# Altium schematic sheet HW_Mechanical_Parts.SchDoc: Mechanical parts
size A4; Date: Not used; ApprovedBy: Not used; CheckedBy: Not used; Author: Not used; CompanyName: STMicroelectronics; DrawnBy: Not used; Engineer: Not used; Organization: Not used; Address1: Not used; Address2: Not used; Address3: Not used; Address4: Not used; DocumentNumber: Not used; Revision: Not used; SheetNumber: 8; SheetTotal: 8; CurrentTime: Not used; CurrentDate: Not used; Time: Not used; DocumentFullPathAndName: Not used; DocumentName: Not used; ModifiedDate: Not used; ImagePath: Not used; ProjectName: Not used; Application_BuildNumber: Not used
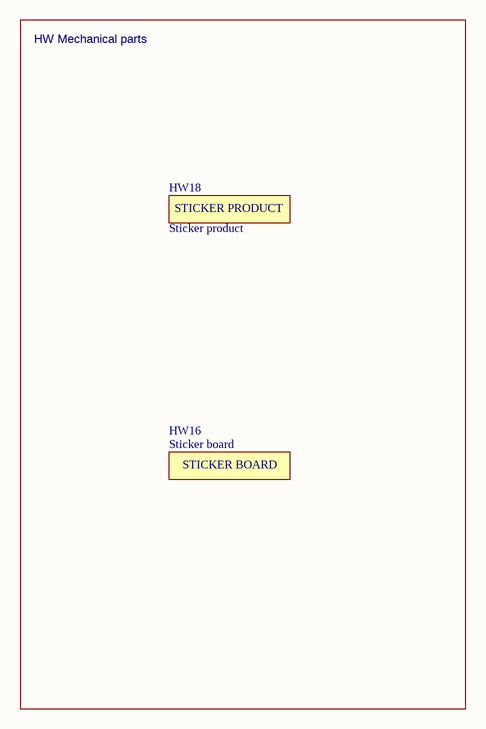
[diagram p0: HW_Mechanical_Parts.SchDoc]

## Parts
HW16  value Sticker board  [STICKER_BOARD_25X9]  (hidden comment: STICKER_BOARD)  (no BOM)
HW18  value Sticker product  [STICKER_PRODUCT_25X9]  (hidden comment: STICKER_PRODUCT)  (no BOM)

## Blocks framed on the sheet
HW Mechanical parts: HW16 HW18

## Notes on the sheet
- Title:
- Project:
- Size:
- Revision:
- Variant:
- A4
- -
- Date:
- Reference:
- Sheet:
- of
- (in symbol MCD-00235) STICKER BOARD
- (in symbol MCD-00547) STICKER PRODUCT

## Library data of the parts
HW16 = MCD-00235: Sticker Board 25x9 mm; Part_Type: Misc; Part_Preference: Recommended; Internal_Part_Number: MCD-00235; Status: Released; Manufacturer_Part_Number: N/A; Manufacturer: N/A; ComponentLink1URL: N/A; Alternate_Manufacturer: N/A; Alternate_Manufacturer_Part_Number: N/A; Package: N/A; Order_Code_Digikey: N/A; Order_Code_Farnell: N/A; Order_Code_RS: N/A
HW18 = MCD-00547: Sticker product 25x9 mm; Part_Type: Misc; Part_Preference: Recommended; Internal_Part_Number: MCD-00547; Status: Released; Manufacturer_Part_Number: N/A; Manufacturer: N/A; ComponentLink1URL: N/A; Alternate_Manufacturer: N/A; Alternate_Manufacturer_Part_Number: N/A; Package: N/A; Order_Code_Digikey: N/A; Order_Code_Farnell: N/A; Order_Code_RS: N/A